# EAGLE design x0_current_sense_v0001 (EAGLE 8.0.0)
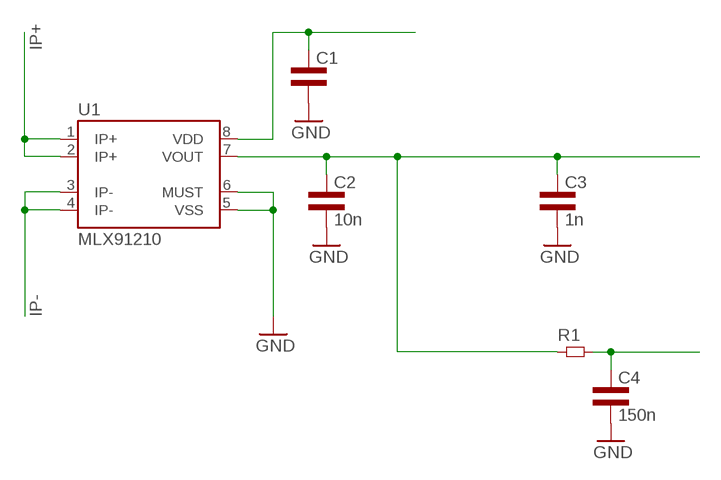
[diagram p0: schematic, sheet 1]

## Parts
C1  CAP0603L3  [0603L3]
C2  10n  CAP0603L3  [0603L3]
C3  1n  CAP0603L3  [0603L3]
C4  150n  CAP0603L3  [0603L3]
R1  RES0603L3  [0603L3]
U1  MLX91210  [SOIC-8]

## Nets
GND: C1.P$2 C2.P$2 C3.P$2 C4.P$2 U1.5(VSS) U1.6(MUST)
IP+: U1.1(IP+) U1.2(IP+)
IP-: U1.3(IP-) U1.4(IP-)
N$1: C4.P$1 R1.P$2
N$3: C1.P$1 U1.8(VDD)
N$4: C2.P$1 C3.P$1 R1.P$1 U1.7(VOUT)

## Library data of the parts
C1-C4 = common:CAP
R1 = common:RES
U1 = common:MLX91210

## Board
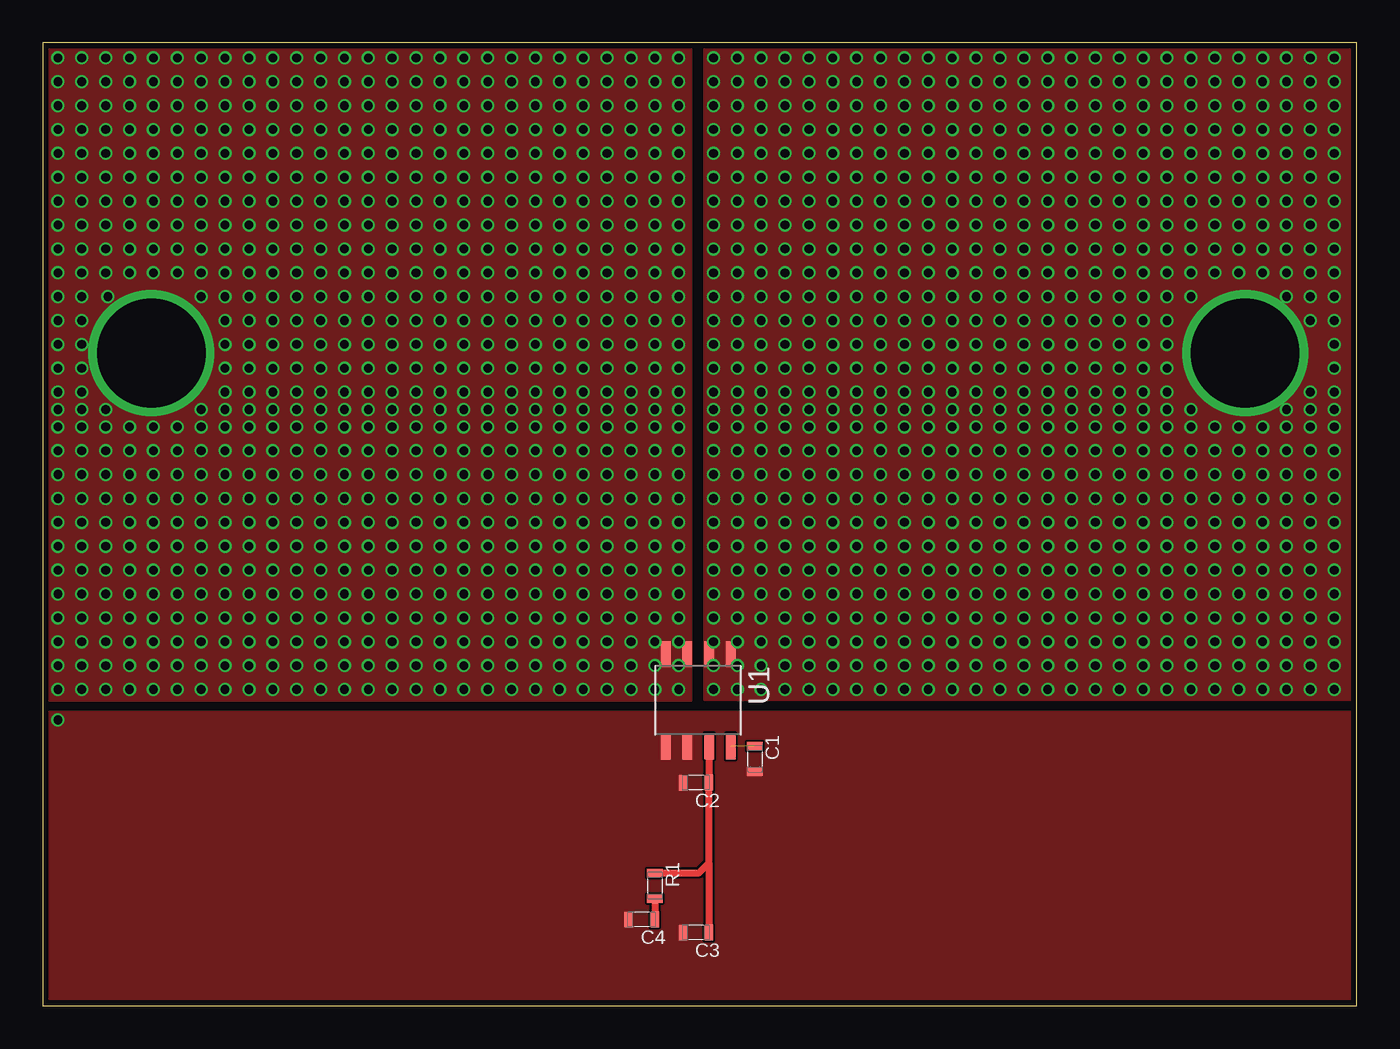
[diagram p1: board, top side]
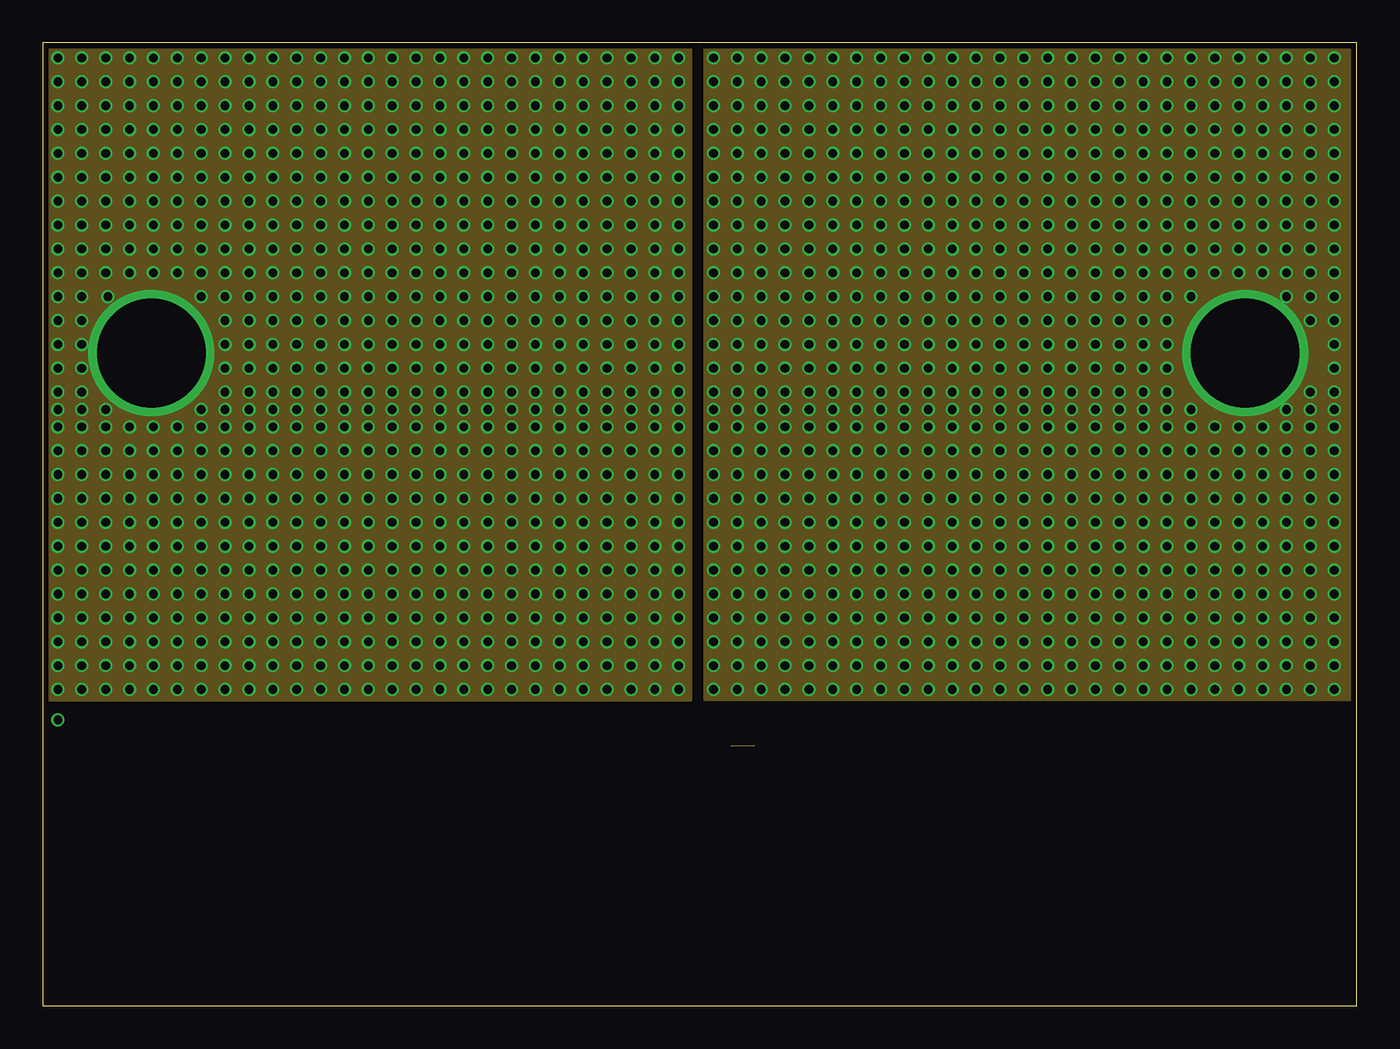
[diagram p2: board, inner layer Route2]
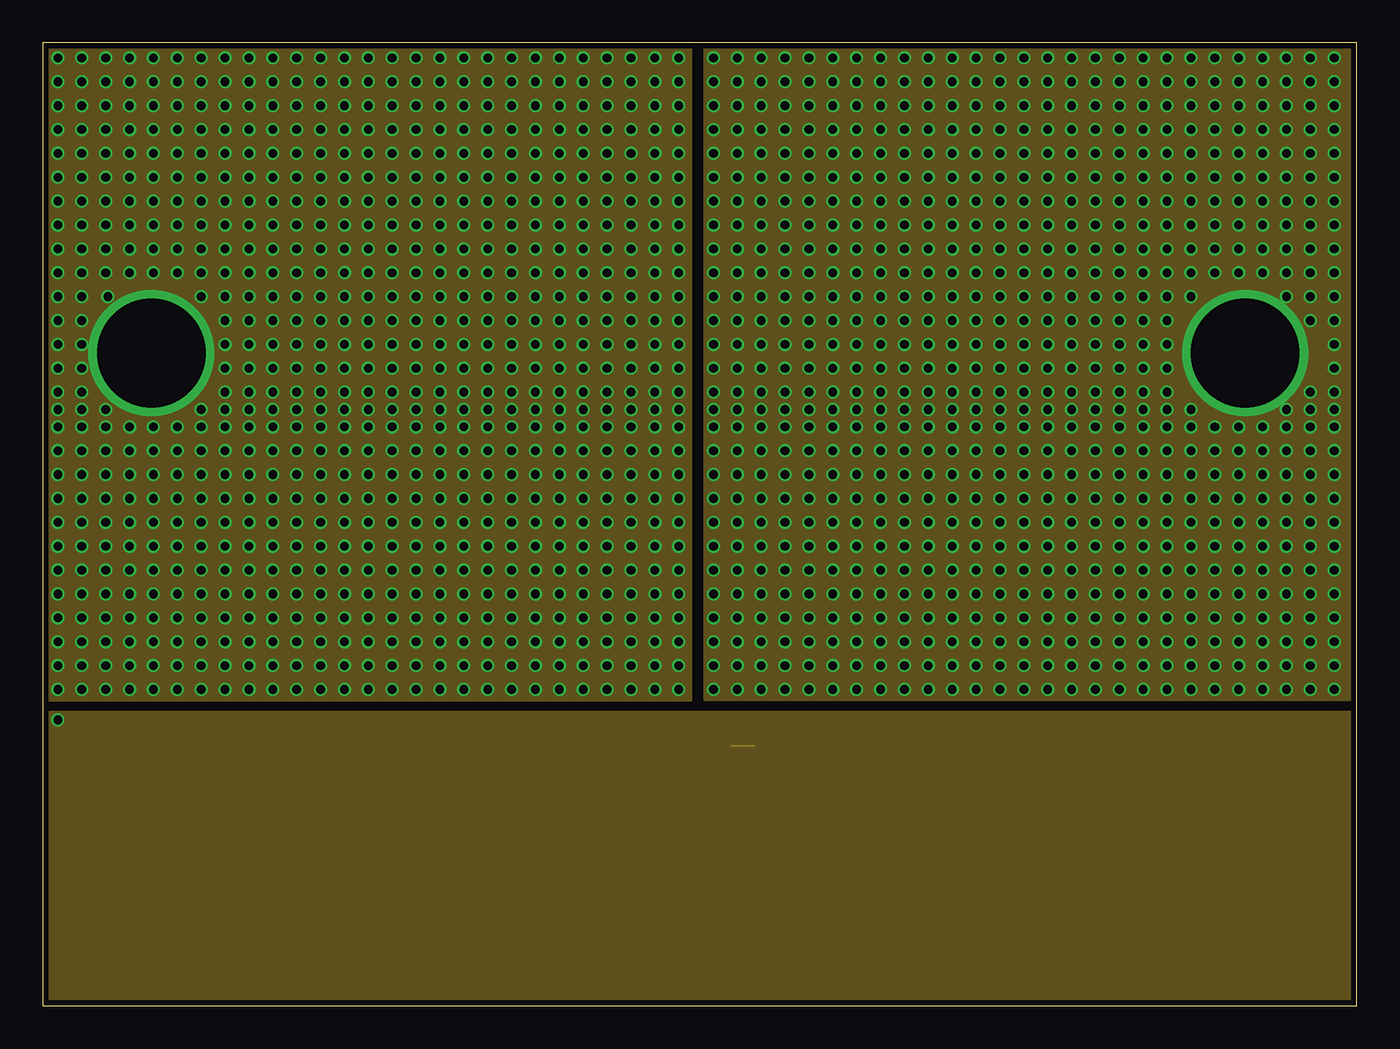
[diagram p3: board, inner layer Route3]
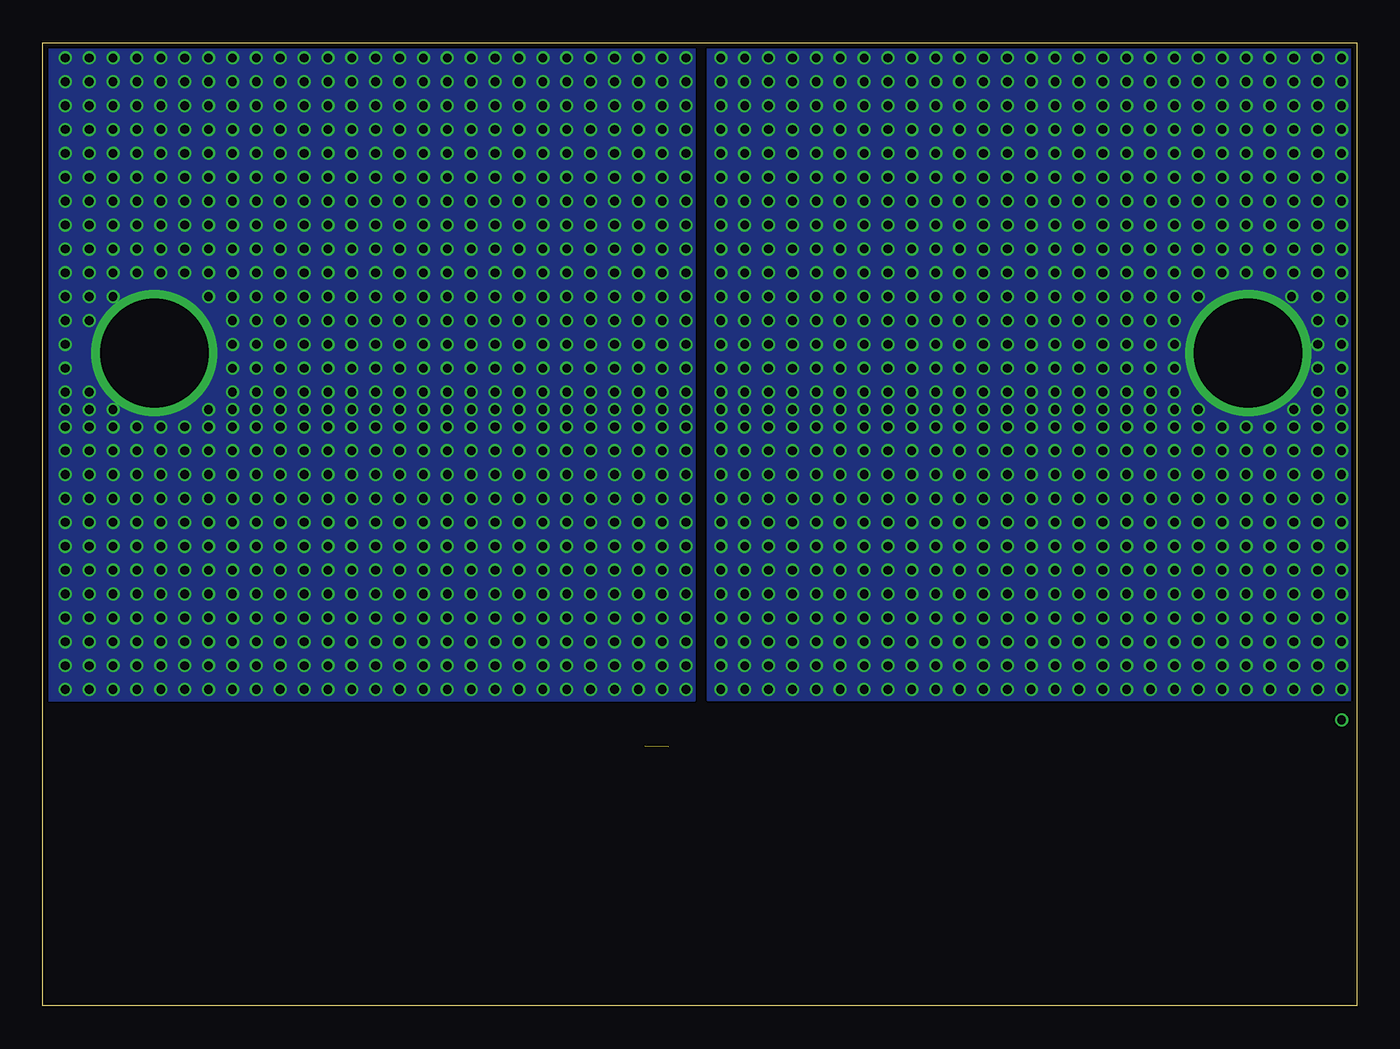
[diagram p4: board, bottom side, seen from below]

Size 76.89 x 56.37 mm. Coordinates in mm from the lower left corner, seen from the top.
Outline: 0,56.37 0,0 76.89,0 76.89,56.37 0,56.37
Copper layers (1*2*3*16): Top 0.035mm / dielectric 1.5mm / Route2 0.035mm / dielectric 0.15mm / Route3 0.035mm / dielectric 0.2mm / Bottom 0.035mm
Design rules "default *": minimum track width 5mil, minimum drill 10mil, track to track 5mil, track to pad 5mil, pad to pad 5mil, via to via 5mil, smd to smd 0mil, copper to edge 13mil, drill to drill 0mil, minimum pad ring 4mil, minimum via ring 4mil, stop-mask expansion 4mil, vias tented up to drill 0mil, thermal gap 10mil

### Footprints (pad centres in the part's own frame; a part is rotated, then mirrored left to right if it is on the bottom)
0603L3 = smd 0.5 x 0.9: P$1 -0.75,0; P$2 0.75,0
SOIC-8 = smd 0.55 x 1.5: 1 -1.905,-2.7; 2 -0.635,-2.7; 3 0.635,-2.7; 4 1.905,-2.7; 5 1.905,2.7; 6 0.635,2.7; 7 -0.635,2.7; 8 -1.905,2.7

### Placement (x,y rotation side)
C1  41.66,14.46 270 top
C2  38.23,13.06 180 top
C3  38.23,4.3 180 top
C4  35.05,5.06 180 top
R1  35.81,7.03 270 top
U1  38.35,17.89 180 top

### Tracks (layer width: path | path; a pad name or v marks a point on that pad's centre or on a via)
GND  (via drill 0.51)
  other vias: 0.89,16.74
  pour Top (no thermals): 76.58,17.25 76.58,0.36 0.38,0.36 0.38,17.25
  pour Route3 (no thermals): 76.58,17.25 76.58,0.36 0.38,0.36 0.38,17.25
IP+  (via drill 0.51, 6.35)
  other vias: 70.36,38.21 39.24,55.48 40.64,55.48 42.04,55.48 43.43,55.48 44.83,55.48 46.23,55.48 47.62,55.48 49.02,55.48 50.42,55.48 51.82,55.48 53.21,55.48 54.61,55.48 56.01,55.48 57.4,55.48 58.8,55.48 60.2,55.48 61.59,55.48 62.99,55.48 64.39,55.48 65.79,55.48 67.18,55.48 68.58,55.48 69.98,55.48 71.37,55.48 72.77,55.48 74.17,55.48 75.56,55.48 39.24,54.08 40.64,54.08 42.04,54.08 43.43,54.08 44.83,54.08 46.23,54.08 47.62,54.08 49.02,54.08 50.42,54.08 51.82,54.08 53.21,54.08 54.61,54.08 56.01,54.08 57.4,54.08 58.8,54.08 60.2,54.08 61.59,54.08 62.99,54.08 64.39,54.08 65.79,54.08 67.18,54.08 68.58,54.08 69.98,54.08 71.37,54.08 72.77,54.08 74.17,54.08 75.56,54.08 39.24,52.69 40.64,52.69 42.04,52.69 43.43,52.69 44.83,52.69 46.23,52.69 47.62,52.69 49.02,52.69 50.42,52.69 51.82,52.69 53.21,52.69 54.61,52.69 56.01,52.69 57.4,52.69 58.8,52.69 60.2,52.69 61.59,52.69 62.99,52.69 64.39,52.69 65.79,52.69 67.18,52.69 68.58,52.69 69.98,52.69 71.37,52.69 72.77,52.69 74.17,52.69 75.56,52.69 39.24,51.29 40.64,51.29 42.04,51.29 43.43,51.29 44.83,51.29 46.23,51.29 47.62,51.29 49.02,51.29 50.42,51.29 51.82,51.29 53.21,51.29 54.61,51.29 56.01,51.29 57.4,51.29 58.8,51.29 60.2,51.29 61.59,51.29 62.99,51.29 64.39,51.29 65.79,51.29 67.18,51.29 68.58,51.29 69.98,51.29 71.37,51.29 72.77,51.29 74.17,51.29 75.56,51.29 39.24,49.89 40.64,49.89 42.04,49.89 43.43,49.89 44.83,49.89 46.23,49.89 47.62,49.89 49.02,49.89 50.42,49.89 51.82,49.89 53.21,49.89 54.61,49.89 56.01,49.89 57.4,49.89 58.8,49.89 60.2,49.89 61.59,49.89 62.99,49.89 64.39,49.89 65.79,49.89 67.18,49.89 68.58,49.89 69.98,49.89 71.37,49.89 72.77,49.89 74.17,49.89 75.56,49.89 39.24,48.49 40.64,48.49 42.04,48.49 43.43,48.49 44.83,48.49 46.23,48.49 47.62,48.49 49.02,48.49 50.42,48.49 51.82,48.49 53.21,48.49 54.61,48.49 56.01,48.49 57.4,48.49 58.8,48.49 60.2,48.49 61.59,48.49 62.99,48.49 64.39,48.49 65.79,48.49 67.18,48.49 68.58,48.49 69.98,48.49 71.37,48.49 72.77,48.49 74.17,48.49 75.56,48.49 39.24,47.1 40.64,47.1 42.04,47.1 43.43,47.1 44.83,47.1 46.23,47.1 47.62,47.1 49.02,47.1 50.42,47.1 51.82,47.1 53.21,47.1 54.61,47.1 56.01,47.1 57.4,47.1 58.8,47.1 60.2,47.1 61.59,47.1 62.99,47.1 64.39,47.1 65.79,47.1 67.18,47.1 68.58,47.1 69.98,47.1 71.37,47.1 72.77,47.1 74.17,47.1 75.56,47.1 39.24,45.7 40.64,45.7 42.04,45.7 43.43,45.7 44.83,45.7 46.23,45.7 47.62,45.7 49.02,45.7 50.42,45.7 51.82,45.7 53.21,45.7 54.61,45.7 56.01,45.7 57.4,45.7 58.8,45.7 60.2,45.7 61.59,45.7 62.99,45.7 64.39,45.7 65.79,45.7 67.18,45.7 68.58,45.7 69.98,45.7 71.37,45.7 72.77,45.7 74.17,45.7 75.56,45.7 39.24,44.3 40.64,44.3 42.04,44.3 43.43,44.3 44.83,44.3 46.23,44.3 47.62,44.3 49.02,44.3 50.42,44.3 51.82,44.3 53.21,44.3 54.61,44.3 56.01,44.3 57.4,44.3 58.8,44.3 60.2,44.3 61.59,44.3 62.99,44.3 64.39,44.3 65.79,44.3 67.18,44.3 68.58,44.3 69.98,44.3 71.37,44.3 72.77,44.3 74.17,44.3 75.56,44.3 39.24,42.91 40.64,42.91 42.04,42.91 43.43,42.91 44.83,42.91 46.23,42.91 47.62,42.91 49.02,42.91 50.42,42.91 51.82,42.91 53.21,42.91 54.61,42.91 56.01,42.91 57.4,42.91 58.8,42.91 60.2,42.91 61.59,42.91 62.99,42.91 64.39,42.91 65.79,42.91 67.18,42.91 68.58,42.91 69.98,42.91 71.37,42.91 72.77,42.91 74.17,42.91 75.56,42.91 39.24,41.51 40.64,41.51 42.04,41.51 43.43,41.51 44.83,41.51 46.23,41.51 47.62,41.51 49.02,41.51 50.42,41.51 51.82,41.51 53.21,41.51 54.61,41.51 56.01,41.51 57.4,41.51 58.8,41.51 60.2,41.51 61.59,41.51 62.99,41.51 64.39,41.51 65.79,41.51 67.18,41.51 72.77,41.51 74.17,41.51 75.56,41.51 39.24,40.11 40.64,40.11 42.04,40.11 43.43,40.11 44.83,40.11 46.23,40.11 47.62,40.11 49.02,40.11 50.42,40.11 51.82,40.11 53.21,40.11 54.61,40.11 56.01,40.11 57.4,40.11 58.8,40.11 60.2,40.11 61.59,40.11 62.99,40.11 64.39,40.11 65.79,40.11 74.17,40.11 75.56,40.11 39.24,38.72 40.64,38.72 42.04,38.72 43.43,38.72 44.83,38.72 46.23,38.72 47.62,38.72 49.02,38.72 50.42,38.72 51.82,38.72 53.21,38.72 54.61,38.72 56.01,38.72 57.4,38.72 58.8,38.72 60.2,38.72 61.59,38.72 62.99,38.72 64.39,38.72 65.79,38.72 75.56,38.72 39.24,37.32 40.64,37.32 42.04,37.32 43.43,37.32 44.83,37.32 46.23,37.32 47.62,37.32 49.02,37.32 50.42,37.32 51.82,37.32 53.21,37.32 54.61,37.32 56.01,37.32 57.4,37.32 58.8,37.32 60.2,37.32 61.59,37.32 62.99,37.32 64.39,37.32 65.79,37.32 75.56,37.32 39.24,35.92 40.64,35.92 42.04,35.92 43.43,35.92 44.83,35.92 46.23,35.92 47.62,35.92 49.02,35.92 50.42,35.92 51.82,35.92 53.21,35.92 54.61,35.92 56.01,35.92 57.4,35.92 58.8,35.92 60.2,35.92 61.59,35.92 62.99,35.92 64.39,35.92 65.79,35.92 74.17,35.92 75.56,35.92 39.24,34.91 40.64,34.91 42.04,34.91 43.43,34.91 44.83,34.91 46.23,34.91 47.62,34.91 49.02,34.91 50.42,34.91 51.82,34.91 53.21,34.91 54.61,34.91 56.01,34.91 57.4,34.91 58.8,34.91 60.2,34.91 61.59,34.91 62.99,34.91 64.39,34.91 65.79,34.91 67.18,34.91 72.77,34.91 74.17,34.91 75.56,34.91 39.24,33.89 40.64,33.89 42.04,33.89 43.43,33.89 44.83,33.89 46.23,33.89 47.62,33.89 49.02,33.89 50.42,33.89 51.82,33.89 53.21,33.89 54.61,33.89 56.01,33.89 57.4,33.89 58.8,33.89 60.2,33.89 61.59,33.89 62.99,33.89 64.39,33.89 65.79,33.89 67.18,33.89 68.58,33.89 69.98,33.89 71.37,33.89 72.77,33.89 74.17,33.89 75.56,33.89 39.24,32.49 40.64,32.49 42.04,32.49 43.43,32.49 44.83,32.49 46.23,32.49 47.62,32.49 49.02,32.49 50.42,32.49 51.82,32.49 53.21,32.49 54.61,32.49 56.01,32.49 57.4,32.49 58.8,32.49 60.2,32.49 61.59,32.49 62.99,32.49 64.39,32.49 65.79,32.49 67.18,32.49 68.58,32.49 69.98,32.49 71.37,32.49 72.77,32.49 74.17,32.49 75.56,32.49 39.24,31.09 40.64,31.09 42.04,31.09 43.43,31.09 44.83,31.09 46.23,31.09 47.62,31.09 49.02,31.09 50.42,31.09 51.82,31.09 53.21,31.09 54.61,31.09 56.01,31.09 57.4,31.09 58.8,31.09 60.2,31.09 61.59,31.09 62.99,31.09 64.39,31.09 65.79,31.09 67.18,31.09 68.58,31.09 69.98,31.09 71.37,31.09 72.77,31.09 74.17,31.09 75.56,31.09 39.24,29.7 40.64,29.7 42.04,29.7 43.43,29.7 44.83,29.7 46.23,29.7 47.62,29.7 49.02,29.7 50.42,29.7 51.82,29.7 53.21,29.7 54.61,29.7 56.01,29.7 57.4,29.7 58.8,29.7 60.2,29.7 61.59,29.7 62.99,29.7 64.39,29.7 65.79,29.7 67.18,29.7 68.58,29.7 69.98,29.7 71.37,29.7 72.77,29.7 74.17,29.7 75.56,29.7 39.24,28.3 40.64,28.3 42.04,28.3 43.43,28.3 44.83,28.3 46.23,28.3 47.62,28.3 49.02,28.3 50.42,28.3 51.82,28.3 53.21,28.3 54.61,28.3 56.01,28.3 57.4,28.3 58.8,28.3 60.2,28.3 61.59,28.3 62.99,28.3 64.39,28.3 65.79,28.3 67.18,28.3 68.58,28.3 69.98,28.3 71.37,28.3 72.77,28.3 74.17,28.3 75.56,28.3 39.24,26.9 40.64,26.9 42.04,26.9 43.43,26.9 44.83,26.9 46.23,26.9 47.62,26.9 49.02,26.9 50.42,26.9 51.82,26.9 53.21,26.9 54.61,26.9 56.01,26.9 57.4,26.9 58.8,26.9 60.2,26.9 61.59,26.9 62.99,26.9 64.39,26.9 65.79,26.9 67.18,26.9 68.58,26.9 69.98,26.9 71.37,26.9 72.77,26.9 74.17,26.9 75.56,26.9 39.24,25.51 40.64,25.51 42.04,25.51 43.43,25.51 44.83,25.51 46.23,25.51 47.62,25.51 49.02,25.51 50.42,25.51 51.82,25.51 53.21,25.51 54.61,25.51 56.01,25.51 57.4,25.51 58.8,25.51 60.2,25.51 61.59,25.51 62.99,25.51 64.39,25.51 65.79,25.51 67.18,25.51 68.58,25.51 69.98,25.51 71.37,25.51 72.77,25.51 74.17,25.51 75.56,25.51 39.24,24.11 40.64,24.11 42.04,24.11 43.43,24.11 44.83,24.11 46.23,24.11 47.62,24.11 49.02,24.11 50.42,24.11 51.82,24.11 53.21,24.11 54.61,24.11 56.01,24.11 57.4,24.11 58.8,24.11 60.2,24.11 61.59,24.11 62.99,24.11 64.39,24.11 65.79,24.11 67.18,24.11 68.58,24.11 69.98,24.11 71.37,24.11 72.77,24.11 74.17,24.11 75.56,24.11 39.24,22.71 40.64,22.71 42.04,22.71 43.43,22.71 44.83,22.71 46.23,22.71 47.62,22.71 49.02,22.71 50.42,22.71 51.82,22.71 53.21,22.71 54.61,22.71 56.01,22.71 57.4,22.71 58.8,22.71 60.2,22.71 61.59,22.71 62.99,22.71 64.39,22.71 65.79,22.71 67.18,22.71 68.58,22.71 69.98,22.71 71.37,22.71 72.77,22.71 74.17,22.71 75.56,22.71 39.24,21.32 40.64,21.32 42.04,21.32 43.43,21.32 44.83,21.32 46.23,21.32 47.62,21.32 49.02,21.32 50.42,21.32 51.82,21.32 53.21,21.32 54.61,21.32 56.01,21.32 57.4,21.32 58.8,21.32 60.2,21.32 61.59,21.32 62.99,21.32 64.39,21.32 65.79,21.32 67.18,21.32 68.58,21.32 69.98,21.32 71.37,21.32 72.77,21.32 74.17,21.32 75.56,21.32 39.24,19.92 40.64,19.92 42.04,19.92 43.43,19.92 44.83,19.92 46.23,19.92 47.62,19.92 49.02,19.92 50.42,19.92 51.82,19.92 53.21,19.92 54.61,19.92 56.01,19.92 57.4,19.92 58.8,19.92 60.2,19.92 61.59,19.92 62.99,19.92 64.39,19.92 65.79,19.92 67.18,19.92 68.58,19.92 69.98,19.92 71.37,19.92 72.77,19.92 74.17,19.92 75.56,19.92 39.24,18.52 40.64,18.52 42.04,18.52 43.43,18.52 44.83,18.52 46.23,18.52 47.62,18.52 49.02,18.52 50.42,18.52 51.82,18.52 53.21,18.52 54.61,18.52 56.01,18.52 57.4,18.52 58.8,18.52 60.2,18.52 61.59,18.52 62.99,18.52 64.39,18.52 65.79,18.52 67.18,18.52 68.58,18.52 69.98,18.52 71.37,18.52 72.77,18.52 74.17,18.52 75.56,18.52
  pour Top (no thermals): 38.73,17.89 38.73,56.11 76.58,56.11 76.58,17.89
  pour Route2 (no thermals): 38.73,17.89 38.73,56.11 76.58,56.11 76.58,17.89
  pour Route3 (no thermals): 38.73,17.89 38.73,56.11 76.58,56.11 76.58,17.89
  pour Bottom (no thermals): 38.73,17.89 38.73,56.11 76.58,56.11 76.58,17.89
IP-  (via drill 0.51, 6.35)
  other vias: 6.35,38.21 0.89,55.48 2.29,55.48 3.68,55.48 5.08,55.48 6.48,55.48 7.87,55.48 9.27,55.48 10.67,55.48 12.06,55.48 13.46,55.48 14.86,55.48 16.26,55.48 17.65,55.48 19.05,55.48 20.45,55.48 21.84,55.48 23.24,55.48 24.64,55.48 26.03,55.48 27.43,55.48 28.83,55.48 30.23,55.48 31.62,55.48 33.02,55.48 34.42,55.48 35.81,55.48 37.21,55.48 0.89,54.08 2.29,54.08 3.68,54.08 5.08,54.08 6.48,54.08 7.87,54.08 9.27,54.08 10.67,54.08 12.06,54.08 13.46,54.08 14.86,54.08 16.26,54.08 17.65,54.08 19.05,54.08 20.45,54.08 21.84,54.08 23.24,54.08 24.64,54.08 26.03,54.08 27.43,54.08 28.83,54.08 30.23,54.08 31.62,54.08 0.89,52.69 2.29,52.69 3.68,52.69 5.08,52.69 6.48,52.69 7.87,52.69 9.27,52.69 10.67,52.69 12.06,52.69 13.46,52.69 14.86,52.69 16.26,52.69 17.65,52.69 19.05,52.69 20.45,52.69 21.84,52.69 23.24,52.69 24.64,52.69 26.03,52.69 27.43,52.69 28.83,52.69 30.23,52.69 31.62,52.69 0.89,51.29 2.29,51.29 3.68,51.29 5.08,51.29 6.48,51.29 7.87,51.29 9.27,51.29 10.67,51.29 12.06,51.29 13.46,51.29 14.86,51.29 16.26,51.29 17.65,51.29 19.05,51.29 20.45,51.29 21.84,51.29 23.24,51.29 24.64,51.29 26.03,51.29 27.43,51.29 28.83,51.29 30.23,51.29 31.62,51.29 0.89,49.89 2.29,49.89 3.68,49.89 5.08,49.89 6.48,49.89 7.87,49.89 9.27,49.89 10.67,49.89 12.06,49.89 13.46,49.89 14.86,49.89 16.26,49.89 17.65,49.89 19.05,49.89 20.45,49.89 21.84,49.89 23.24,49.89 24.64,49.89 26.03,49.89 27.43,49.89 28.83,49.89 30.23,49.89 31.62,49.89 0.89,48.49 2.29,48.49 3.68,48.49 5.08,48.49 6.48,48.49 7.87,48.49 9.27,48.49 10.67,48.49 12.06,48.49 13.46,48.49 14.86,48.49 16.26,48.49 17.65,48.49 19.05,48.49 20.45,48.49 21.84,48.49 23.24,48.49 24.64,48.49 26.03,48.49 27.43,48.49 28.83,48.49 30.23,48.49 31.62,48.49 0.89,47.1 2.29,47.1 3.68,47.1 5.08,47.1 6.48,47.1 7.87,47.1 9.27,47.1 10.67,47.1 12.06,47.1 13.46,47.1 14.86,47.1 16.26,47.1 17.65,47.1 19.05,47.1 20.45,47.1 21.84,47.1 23.24,47.1 24.64,47.1 26.03,47.1 27.43,47.1 28.83,47.1 30.23,47.1 31.62,47.1 0.89,45.7 2.29,45.7 3.68,45.7 5.08,45.7 6.48,45.7 7.87,45.7 9.27,45.7 10.67,45.7 12.06,45.7 13.46,45.7 14.86,45.7 16.26,45.7 17.65,45.7 19.05,45.7 20.45,45.7 21.84,45.7 23.24,45.7 24.64,45.7 26.03,45.7 27.43,45.7 28.83,45.7 30.23,45.7 31.62,45.7 0.89,44.3 2.29,44.3 3.68,44.3 5.08,44.3 6.48,44.3 7.87,44.3 9.27,44.3 10.67,44.3 12.06,44.3 13.46,44.3 14.86,44.3 16.26,44.3 17.65,44.3 19.05,44.3 20.45,44.3 21.84,44.3 23.24,44.3 24.64,44.3 26.03,44.3 27.43,44.3 28.83,44.3 30.23,44.3 31.62,44.3 0.89,42.91 2.29,42.91 3.68,42.91 5.08,42.91 6.48,42.91 7.87,42.91 9.27,42.91 10.67,42.91 12.06,42.91 13.46,42.91 14.86,42.91 16.26,42.91 17.65,42.91 19.05,42.91 20.45,42.91 21.84,42.91 23.24,42.91 24.64,42.91 26.03,42.91 27.43,42.91 28.83,42.91 30.23,42.91 31.62,42.91 0.89,18.52 2.29,18.52 3.68,18.52 5.08,18.52 6.48,18.52 7.87,18.52 9.27,18.52 10.67,18.52 12.06,18.52 13.46,18.52 14.86,18.52 16.26,18.52 17.65,18.52 19.05,18.52 20.45,18.52 21.84,18.52 23.24,18.52 24.64,18.52 26.03,18.52 27.43,18.52 28.83,18.52 30.23,18.52 31.62,18.52 0.89,19.92 2.29,19.92 3.68,19.92 5.08,19.92 6.48,19.92 7.87,19.92 9.27,19.92 10.67,19.92 12.06,19.92 13.46,19.92 14.86,19.92 16.26,19.92 17.65,19.92 19.05,19.92 20.45,19.92 21.84,19.92 23.24,19.92 24.64,19.92 26.03,19.92 27.43,19.92 28.83,19.92 30.23,19.92 31.62,19.92 0.89,21.32 2.29,21.32 3.68,21.32 5.08,21.32 6.48,21.32 7.87,21.32 9.27,21.32 10.67,21.32 12.06,21.32 13.46,21.32 14.86,21.32 16.26,21.32 17.65,21.32 19.05,21.32 20.45,21.32 21.84,21.32 23.24,21.32 24.64,21.32 26.03,21.32 27.43,21.32 28.83,21.32 30.23,21.32 31.62,21.32 0.89,22.71 2.29,22.71 3.68,22.71 5.08,22.71 6.48,22.71 7.87,22.71 9.27,22.71 10.67,22.71 12.06,22.71 13.46,22.71 14.86,22.71 16.26,22.71 17.65,22.71 19.05,22.71 20.45,22.71 21.84,22.71 23.24,22.71 24.64,22.71 26.03,22.71 27.43,22.71 28.83,22.71 30.23,22.71 31.62,22.71 0.89,24.11 2.29,24.11 3.68,24.11 5.08,24.11 6.48,24.11 7.87,24.11 9.27,24.11 10.67,24.11 12.06,24.11 13.46,24.11 14.86,24.11 16.26,24.11 17.65,24.11 19.05,24.11 20.45,24.11 21.84,24.11 23.24,24.11 24.64,24.11 26.03,24.11 27.43,24.11 28.83,24.11 30.23,24.11 31.62,24.11 0.89,25.51 2.29,25.51 3.68,25.51 5.08,25.51 6.48,25.51 7.87,25.51 9.27,25.51 10.67,25.51 12.06,25.51 13.46,25.51 14.86,25.51 16.26,25.51 17.65,25.51 19.05,25.51 20.45,25.51 21.84,25.51 23.24,25.51 24.64,25.51 26.03,25.51 27.43,25.51 28.83,25.51 30.23,25.51 31.62,25.51 0.89,26.9 2.29,26.9 3.68,26.9 5.08,26.9 6.48,26.9 7.87,26.9 9.27,26.9 10.67,26.9 12.06,26.9 13.46,26.9 14.86,26.9 16.26,26.9 17.65,26.9 19.05,26.9 20.45,26.9 21.84,26.9 23.24,26.9 24.64,26.9 26.03,26.9 27.43,26.9 28.83,26.9 30.23,26.9 31.62,26.9 0.89,28.3 2.29,28.3 3.68,28.3 5.08,28.3 6.48,28.3 7.87,28.3 9.27,28.3 10.67,28.3 12.06,28.3 13.46,28.3 14.86,28.3 16.26,28.3 17.65,28.3 19.05,28.3 20.45,28.3 21.84,28.3 23.24,28.3 24.64,28.3 26.03,28.3 27.43,28.3 28.83,28.3 30.23,28.3 31.62,28.3 0.89,29.7 2.29,29.7 3.68,29.7 5.08,29.7 6.48,29.7 7.87,29.7 9.27,29.7 10.67,29.7 12.06,29.7 13.46,29.7 14.86,29.7 16.26,29.7 17.65,29.7 19.05,29.7 20.45,29.7 21.84,29.7 23.24,29.7 24.64,29.7 26.03,29.7 27.43,29.7 28.83,29.7 30.23,29.7 31.62,29.7 0.89,31.09 2.29,31.09 3.68,31.09 5.08,31.09 6.48,31.09 7.87,31.09 9.27,31.09 10.67,31.09 12.06,31.09 13.46,31.09 14.86,31.09 16.26,31.09 17.65,31.09 19.05,31.09 20.45,31.09 21.84,31.09 23.24,31.09 24.64,31.09 26.03,31.09 27.43,31.09 28.83,31.09 30.23,31.09 31.62,31.09 0.89,32.49 2.29,32.49 3.68,32.49 5.08,32.49 6.48,32.49 7.87,32.49 9.27,32.49 10.67,32.49 12.06,32.49 13.46,32.49 14.86,32.49 16.26,32.49 17.65,32.49 19.05,32.49 20.45,32.49 21.84,32.49 23.24,32.49 24.64,32.49 26.03,32.49 27.43,32.49 28.83,32.49 30.23,32.49 31.62,32.49 0.89,33.89 2.29,33.89 3.68,33.89 5.08,33.89 6.48,33.89 7.87,33.89 9.27,33.89 10.67,33.89 12.06,33.89 13.46,33.89 14.86,33.89 16.26,33.89 17.65,33.89 19.05,33.89 20.45,33.89 21.84,33.89 23.24,33.89 24.64,33.89 26.03,33.89 27.43,33.89 28.83,33.89 30.23,33.89 31.62,33.89 10.67,41.51 12.06,41.51 13.46,41.51 14.86,41.51 16.26,41.51 17.65,41.51 19.05,41.51 20.45,41.51 21.84,41.51 23.24,41.51 24.64,41.51 26.03,41.51 27.43,41.51 28.83,41.51 30.23,41.51 31.62,41.51 10.67,40.11 12.06,40.11 13.46,40.11 14.86,40.11 16.26,40.11 17.65,40.11 19.05,40.11 20.45,40.11 21.84,40.11 23.24,40.11 24.64,40.11 26.03,40.11 27.43,40.11 28.83,40.11 30.23,40.11 31.62,40.11 10.67,38.72 12.06,38.72 13.46,38.72 14.86,38.72 16.26,38.72 17.65,38.72 19.05,38.72 20.45,38.72 21.84,38.72 23.24,38.72 24.64,38.72 26.03,38.72 27.43,38.72 28.83,38.72 30.23,38.72 31.62,38.72 10.67,37.32 12.06,37.32 13.46,37.32 14.86,37.32 16.26,37.32 17.65,37.32 19.05,37.32 20.45,37.32 21.84,37.32 23.24,37.32 24.64,37.32 26.03,37.32 27.43,37.32 28.83,37.32 30.23,37.32 31.62,37.32 10.67,35.92 12.06,35.92 13.46,35.92 14.86,35.92 16.26,35.92 17.65,35.92 19.05,35.92 20.45,35.92 21.84,35.92 23.24,35.92 24.64,35.92 26.03,35.92 27.43,35.92 28.83,35.92 30.23,35.92 31.62,35.92 10.67,34.91 12.06,34.91 13.46,34.91 14.86,34.91 16.26,34.91 17.65,34.91 19.05,34.91 20.45,34.91 21.84,34.91 23.24,34.91 24.64,34.91 26.03,34.91 27.43,34.91 28.83,34.91 30.23,34.91 31.62,34.91 33.02,54.08 34.42,54.08 35.81,54.08 37.21,54.08 33.02,52.69 34.42,52.69 35.81,52.69 37.21,52.69 33.02,51.29 34.42,51.29 35.81,51.29 37.21,51.29 33.02,49.89 34.42,49.89 35.81,49.89 37.21,49.89 33.02,48.49 34.42,48.49 35.81,48.49 37.21,48.49 33.02,47.1 34.42,47.1 35.81,47.1 37.21,47.1 33.02,45.7 34.42,45.7 35.81,45.7 37.21,45.7 33.02,44.3 34.42,44.3 35.81,44.3 37.21,44.3 33.02,42.91 34.42,42.91 35.81,42.91 37.21,42.91 33.02,41.51 34.42,41.51 35.81,41.51 37.21,41.51 33.02,40.11 34.42,40.11 35.81,40.11 37.21,40.11 33.02,38.72 34.42,38.72 35.81,38.72 37.21,38.72 33.02,37.32 34.42,37.32 35.81,37.32 37.21,37.32 33.02,35.92 34.42,35.92 35.81,35.92 37.21,35.92 33.02,34.91 34.42,34.91 35.81,34.91 37.21,34.91 33.02,33.89 34.42,33.89 35.81,33.89 37.21,33.89 33.02,32.49 34.42,32.49 35.81,32.49 37.21,32.49 33.02,31.09 34.42,31.09 35.81,31.09 37.21,31.09 33.02,29.7 34.42,29.7 35.81,29.7 37.21,29.7 33.02,28.3 34.42,28.3 35.81,28.3 37.21,28.3 33.02,26.9 34.42,26.9 35.81,26.9 37.21,26.9 33.02,25.51 34.42,25.51 35.81,25.51 37.21,25.51 33.02,24.11 34.42,24.11 35.81,24.11 37.21,24.11 33.02,22.71 34.42,22.71 35.81,22.71 37.21,22.71 33.02,21.32 34.42,21.32 35.81,21.32 37.21,21.32 33.02,19.92 34.42,19.92 35.81,19.92 37.21,19.92 33.02,18.52 34.42,18.52 35.81,18.52 37.21,18.52 9.27,41.51 9.27,34.91 3.81,41.51 2.29,41.51 0.89,41.51 0.89,40.11 2.29,40.11 0.89,38.72 2.29,38.72 0.89,37.32 0.89,35.92 0.89,34.91 2.29,37.32 2.29,35.92 2.29,34.91 3.68,34.91
  pour Top (no thermals): 37.97,17.89 37.97,56.11 0.25,56.11 0.25,17.89
  pour Route2 (no thermals): 37.97,17.89 37.97,56.11 0.25,56.11 0.25,17.89
  pour Route3 (no thermals): 37.97,17.89 37.97,56.11 0.25,56.11 0.25,17.89
  pour Bottom (no thermals): 37.97,17.89 37.97,56.11 0.25,56.11 0.25,17.89
N$1
  Top 0.406: R1.P$2 35.81,5.07 C4.P$1
N$3  (1 unrouted)
N$4
  Top 0.406: R1.P$1 38.39,7.78 38.98,8.36 | U1.7 38.99,13.07 C2.P$1 38.98,8.36 | 38.98,8.36 C3.P$1